# Altium schematic sheet Ethernet.SchDoc: Ethernet
size A3; Author: A.Horvath; Organization: Reichle & De-Massari; Address1: Binzstrasse 32; Address2: 8620 Wetzikon; Address3: Switzerland; DocumentNumber: 8; Revision: V0.1; SheetNumber: 8; SheetTotal: 11
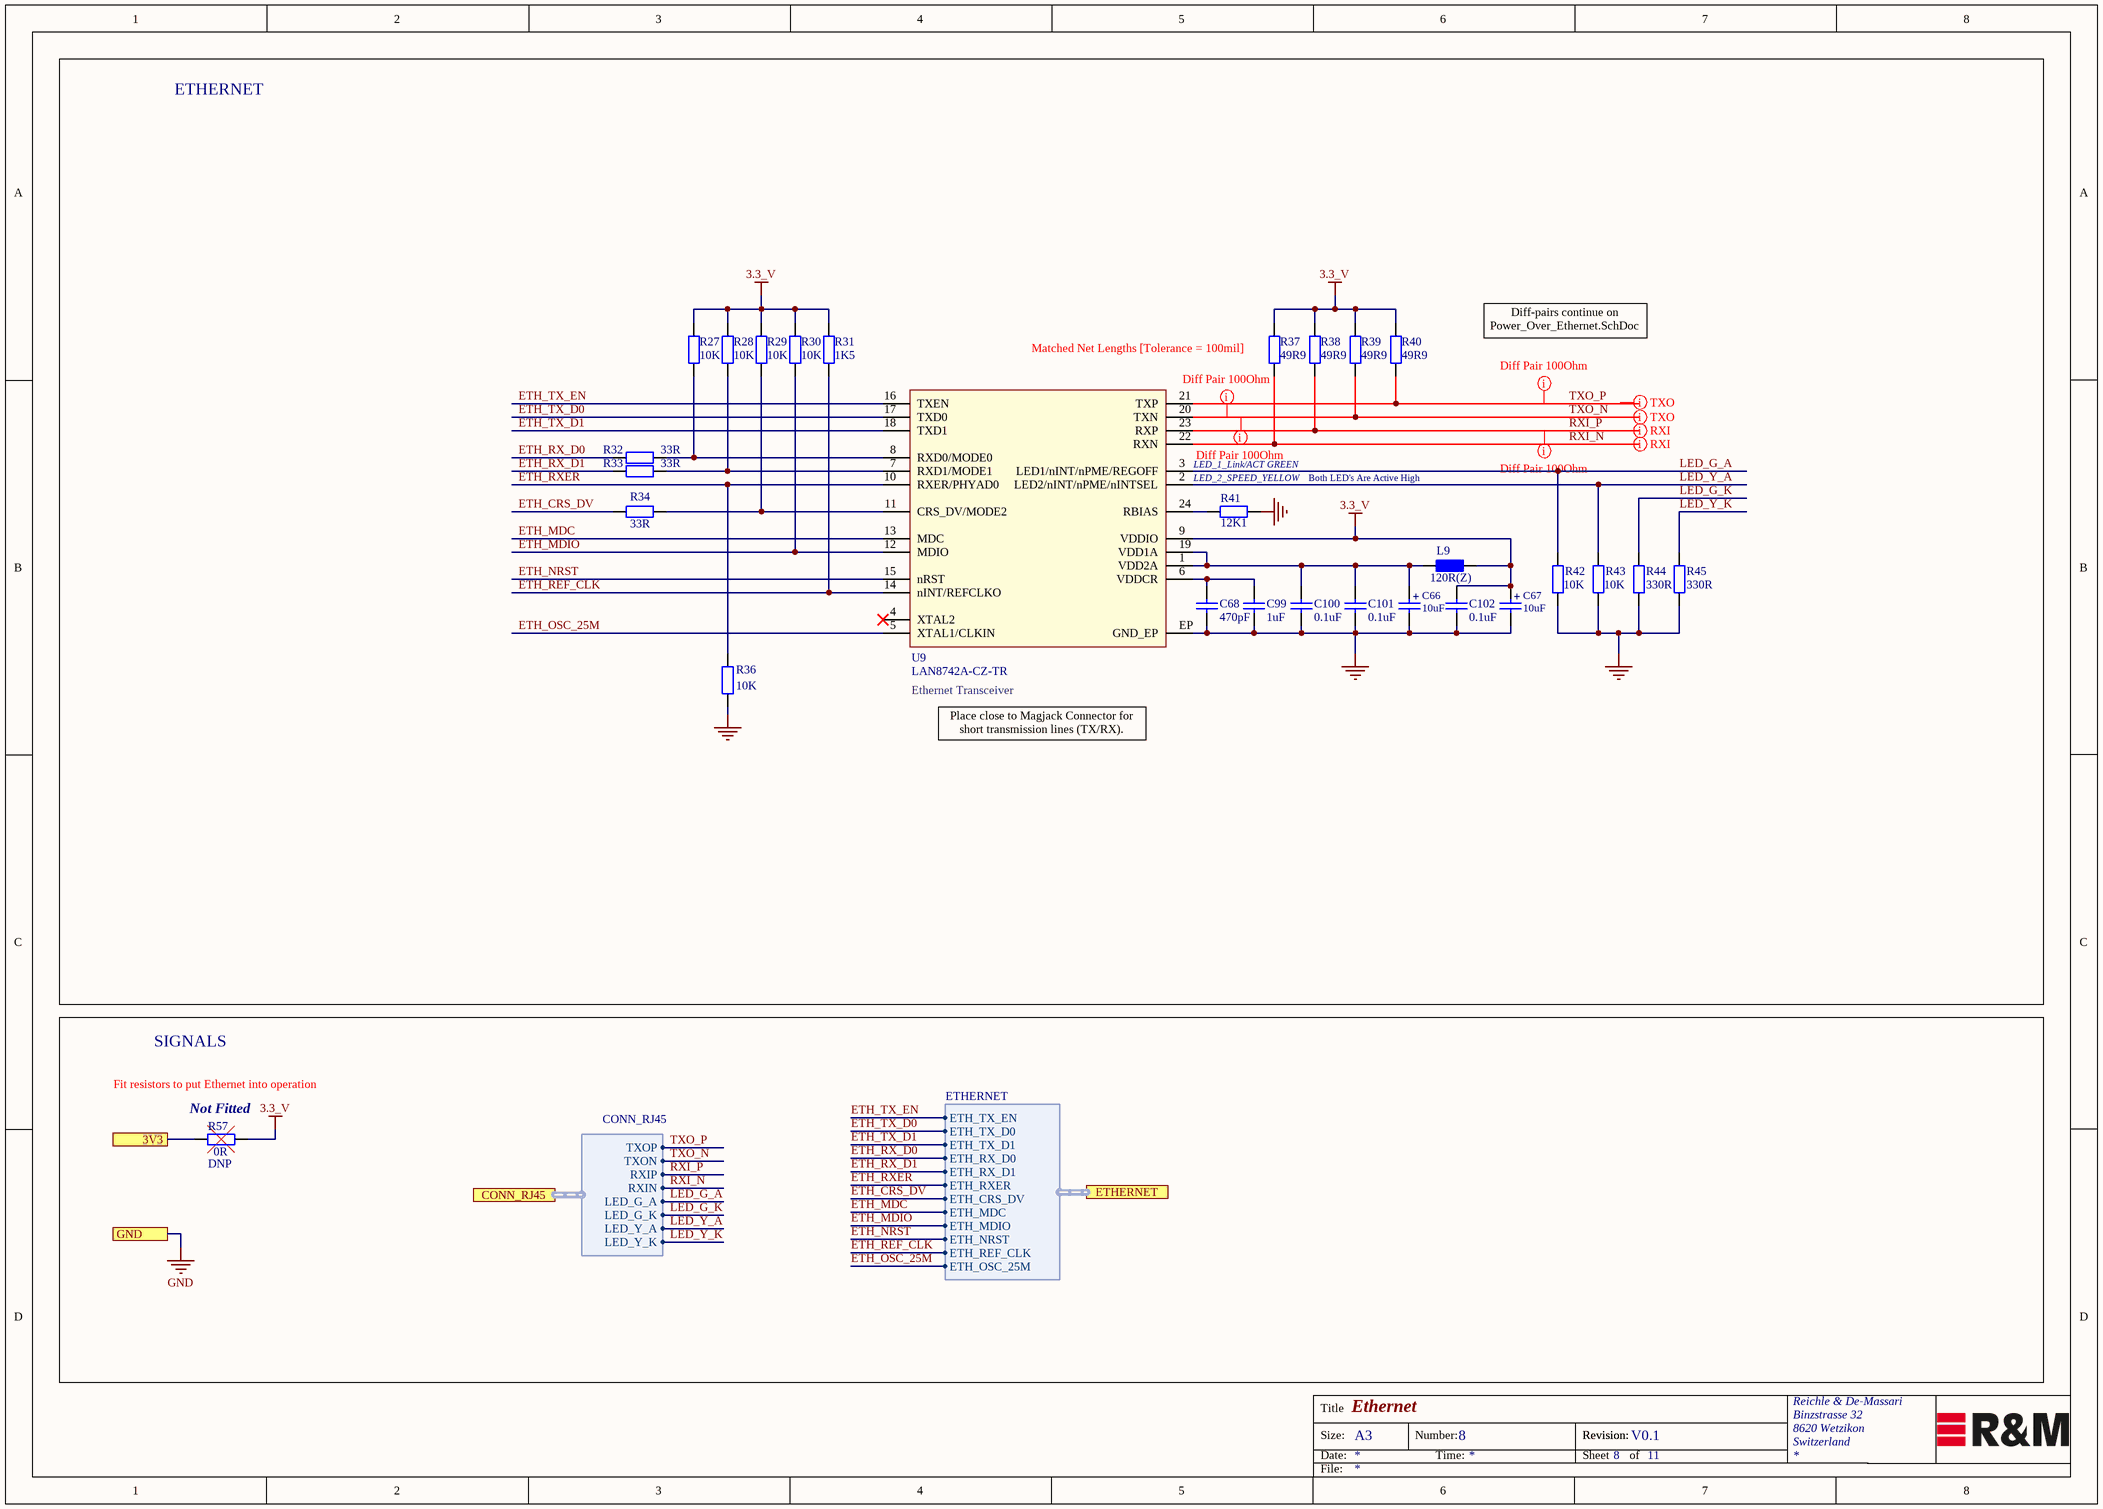
[diagram p0: Ethernet.SchDoc]

## Parts
C66  10uF  [293D106X9010A2TE3]
C67  10uF  [293D106X9010A2TE3]
C68  470pF  [Ceramic Capacitor 0402 EIA]
C99  1uF  [Ceramic Capacitor 0402 EIA]
C100  0.1uF  [Ceramic Capacitor 0402 EIA]
C101  0.1uF  [Ceramic Capacitor 0402 EIA]
C102  0.1uF  [Ceramic Capacitor 0402 EIA]
L9  120R(Z)  [Inductor 0603 EIA]
R27  10K  [Resistor 0402 EIA]
R28  10K  [Resistor 0402 EIA]
R29  10K  [Resistor 0402 EIA]
R30  10K  [Resistor 0402 EIA]
R31  1K5  [Resistor 0402 EIA]
R32  33R  [Resistor 0402 EIA]
R33  33R  [Resistor 0402 EIA]
R34  33R  [Resistor 0402 EIA]
R36  10K  [Resistor 0402 EIA]
R37  49R9  [Resistor 0402 EIA]
R38  49R9  [Resistor 0402 EIA]
R39  49R9  [Resistor 0402 EIA]
R40  49R9  [Resistor 0402 EIA]
R41  12K1  [Resistor 0402 EIA]
R42  10K  [Resistor 0402 EIA]
R43  10K  [Resistor 0402 EIA]
R44  330R  [Resistor 0402 EIA]
R45  330R  [Resistor 0402 EIA]
R57  DNP  [Resistor 0805 EIA]
U9  LAN8742A-CZ-TR  [VQFN24-EPAD_4X4]

## Blocks framed on the sheet
ETHERNET: C66-C68 C99-C102 L9 R27-R34 R36-R45 U9
SIGNALS: R57

## Ports
3V3, CONN_RJ45 (harness CONN_RJ45), ETHERNET (harness ETHERNET), GND

## Harnesses
CONN_RJ45: TXOP, TXON, RXIP, RXIN, LED_G_A, LED_G_K, LED_Y_A, LED_Y_K
ETHERNET: ETH_TX_EN, ETH_TX_D0, ETH_TX_D1, ETH_RX_D0, ETH_RX_D1, ETH_RXER, ETH_CRS_DV, ETH_MDC, ETH_MDIO, ETH_NRST, ETH_REF_CLK, ETH_OSC_25M

## Nets
3.3_V: C67.1(Pos) C102.2 L9.2 R27.1 R28.1 R29.1 R30.1 R31.1 R37.1 R38.1 R39.1 R40.1 R57.2 U9.9(VDDIO)
GND: C66.2(Neg) C67.2(Neg) C68.1 C99.1 C100.1 C101.1 C102.1 R36.2 R41.2 R42.2 R43.2 R44.2 R45.2 U9.EP(GND_EP) ; port GND
3V3: R57.1 ; port 3V3
ETH_CRS_DV: R34.1 ; port ETHERNET.ETH_CRS_DV
ETH_MDC: U9.13(MDC) ; port ETHERNET.ETH_MDC
ETH_MDIO: R30.2 U9.12(MDIO) ; port ETHERNET.ETH_MDIO
ETH_NRST: U9.15(nRST) ; port ETHERNET.ETH_NRST
ETH_OSC_25M: U9.5(XTAL1/CLKIN) ; port ETHERNET.ETH_OSC_25M
ETH_REF_CLK: R31.2 U9.14(nINT/REFCLKO) ; port ETHERNET.ETH_REF_CLK
ETH_RX_D0: R32.1 ; port ETHERNET.ETH_RX_D0
ETH_RX_D1: R33.1 ; port ETHERNET.ETH_RX_D1
ETH_RXER: R36.1 U9.10(RXER/PHYAD0) ; port ETHERNET.ETH_RXER
ETH_TX_D0: U9.17(TXD0) ; port ETHERNET.ETH_TX_D0
ETH_TX_D1: U9.18(TXD1) ; port ETHERNET.ETH_TX_D1
ETH_TX_EN: U9.16(TXEN) ; port ETHERNET.ETH_TX_EN
LED_G_A: R42.1 U9.3(LED1/nINT/nPME/REGOFF) ; port CONN_RJ45.LED_G_A
LED_G_K: R44.1 ; port CONN_RJ45.LED_G_K
LED_Y_A: R43.1 U9.2(LED2/nINT/nPME/nINTSEL) ; port CONN_RJ45.LED_Y_A
LED_Y_K: R45.1 ; port CONN_RJ45.LED_Y_K
RXI_N: R37.2 U9.22(RXN) ; port CONN_RJ45.RXIN
RXI_P: R38.2 U9.23(RXP) ; port CONN_RJ45.RXIP
TXO_N: R39.2 U9.20(TXN) ; port CONN_RJ45.TXON
TXO_P: R40.2 U9.21(TXP) ; port CONN_RJ45.TXOP
NetC66_1: C66.1(Pos) C100.2 C101.2 L9.1 U9.1(VDD2A) U9.19(VDD1A)
NetC68_2: C68.2 C99.2 U9.6(VDDCR)
NetR27_2: R27.2 R32.2 U9.8(RXD0/MODE0)
NetR28_2: R28.2 R33.2 U9.7(RXD1/MODE1)
NetR29_2: R29.2 R34.2 U9.11(CRS_DV/MODE2)
NetR41_1: R41.1 U9.24(RBIAS)

Not connected (* = marked no-connect by the designer): U9 4(XTAL2)*

## Layout directives
mark named Diff Pair 100Ohm: RXI_P, TXO_N, TXO_P
differential pair: (no net found under the mark), RXI_N, RXI_P, TXO_N

## Notes on the sheet
- (near R37) Matched Net Lengths [Tolerance = 100mil]
- Diff-pairs continue on Power_Over_Ethernet.SchDoc
- LED_1_Link/ACT GREEN
- LED_2_SPEED_YELLOW
- Both LED's Are Active High
- (near U9) Ethernet Transceiver
- Place close to Magjack Connector for short transmission lines (TX/RX).
- (near R57) Fit resistors to put Ethernet into operation
- (near R57) Not Fitted
- (near R57) 0R
- Title
- Size:
- Date:
- A3
- Number:
- Time:
- Revision:
- Sheet
- of
- File:
- (in symbol Cap_10uF_1206 _10V_Tantal) +

## Library data of the parts
C66 C67 = Cap_10uF_1206 _10V_Tantal: 10µF Molded Tantalum Capacitors 10V 1206 (3216 Metric) 3.4Ohm; Manufacturer: Vishay Sprague; Replaceable: yes; tolerance: ±10%; Dielectric Grade: TANTAL; Manufacturer PartNr: 293D106X9010A2TE3; voltage: 10V; Footprint/Package: 1206 (3216 metric); value: 10uF; Supplier 1: Digi-Key; Supplier Part Number 1: 718-1121-1-ND
C68 = Cap_470pF_0402_16V: 470pF ±10% 16V Ceramic Capacitor X7R 0402 (1005 Metric); Manufacturer: AVX Corporation; Manufacturer PartNr: 0402YC471KAT2A; voltage: 16VDC; Replaceable: yes; value: 470pF; tolerance: 10%; ComponentLink1Description: mouser; ComponentLink1URL: https://www.mouser.ch/ProductDetail/Murata-Electronics/GRM155R61A472KA01D?qs=sGAEpiMZZMs0AnBnWHyRQJuLogdu9bcTuSYPL0o17LI%3d; Footprint/Package: 0402 (1005 metric); Dielectric Grade: X7R; Supplier 1: Digi-Key; Supplier Part Number 1: 478-12657-1-ND
C99 = Cap_1uF_0603_16V: 1µF ±10% 16V Ceramic Capacitor X5R 0603 (1608 Metric); Manufacturer: Yageo; Manufacturer PartNr: CC0603KRX5R7BB105; voltage: 16VDC; Replaceable: yes; value: 1uF; tolerance: 10%; Footprint/Package: 0603 (1608 Metric); Dielectric Grade: X5R; ComponentLink1Description: mouser; ComponentLink1URL: https://www.mouser.ch/ProductDetail/Murata-Electronics/GCM155C71A105KE38D?qs=sGAEpiMZZMsh%252b1woXyUXj0FEAttKcN54ouz5zO04smg%3d; Supplier Part Number 1: 311-1444-1-ND; Supplier 1: Digi-Key
C100-C102 = Cap_0.1uF_0402_16V_10%: 0.1µF ±10% 16V Ceramic Capacitor X7R 0402 (1005 Metric); Manufacturer: Yageo; Manufacturer PartNr: CC0402KRX7R7BB104; voltage: 16VDC; Replaceable: yes; value: 0.1uF; tolerance: 10%; Footprint/Package: 0402 (1005 Metric); Dielectric Grade: X7R; ComponentLink1Description: mouser; ComponentLink1URL: https://www.mouser.ch/ProductDetail/KEMET/C0402C104M4RACAUTO?qs=sGAEpiMZZMs0AnBnWHyRQB295tntAovf0Dzw3tVX6zRfKTwHFThmZw%3d%3d; Supplier 1: Digi-Key; Supplier Part Number 1: 311-1338-1-ND
L9 = Ferrit_Bead_0603_BLM18PG121SN1D: 120 Ohms @ 100MHz 1 Power Line Ferrite Bead 0603 (1608 Metric) 2A 50mOhm; Manufacturer: Murata Electronics; Replaceable: yes; value: 120R(Z); tolerance: -; power: -; Manufacturer PartNr: BLM18PG121SN1D; Footprint/Package: 0603 (1608 metric); Supplier 1: Digi-Key; Supplier Part Number 1: 490-1037-1-ND; Dielectric Grade: -
R27-R30 R36 R42 R43 = Res_10K_0402: SMD 10K ohm 1% 50V General Purpose; Manufacturer: Yageo; Manufacturer PartNr: RC0402FR-1010KL; power: 63mW; Replaceable: yes; value: 10K; tolerance: 1%; ComponentLink1Description: mouser; ComponentLink1URL: https://www.mouser.ch/ProductDetail/Yageo/RC0402FR-1010KL?qs=sGAEpiMZZMtlubZbdhIBIEgN9MQql2m6Sb2LnYlCICU%3d; Footprint/Package: 0402; Supplier 1: Mouser; Supplier Part Number 1: 603-RC0402FR-1010KL; Supplier 2: Digi-Key; Supplier Part Number 2: *
R31 = Res_1K5_0402: 1 kOhms ±0.5% 0.063W, 1/16W Chip Resistor 0402 (1005 Metric) Thin Film; Manufacturer: TE Connectivity; Manufacturer PartNr: CRGCQ0402F1K5; tolerance: ±1%; Replaceable: yes; value: 1K5; power: 1/16W; Footprint/Package: 0402 (1005 metric); Supplier 1: Digi-Key; Supplier Part Number 1: A129629CT-ND
R32-R34 = Res_33R_0402: 33 Ohms ±0.1% 0.063W, 1/16W Chip Resistor 0402 (1005 Metric) Thin Film; Manufacturer: TE Connectivity; Manufacturer PartNr: CPF0402B33RE1; Replaceable: yes; Dielectric Grade: -; Footprint/Package: 0402 (1005metric); power: 0.063W, 1/16W; Supplier 1: Digi-Key; Supplier Part Number 1: A102801CT-ND; tolerance: ±0.1%; value: 33R
R37-R40 = Res_49R9_0402: 49.9 Ohms ±0.1% 0.063W, 1/16W Chip Resistor 0402 (1005 Metric) Automotive AEC-Q200 Thin Film; Manufacturer: Panasonic Electronic Components; Manufacturer PartNr: ERA-2AEB49R9X; Replaceable: yes; voltage: NA; value: 49R9; tolerance: ±0.1%; power: 0.063W, 1/16W; Footprint/Package: 0402 (1005 metric); Supplier 1: Digi-Key; Supplier Part Number 1: P49.9DCCT-ND; DIelectric Grade: NA
R41 = Res_12K1_0402: 12.1 kOhms ±1% 0.063W, 1/16W Chip Resistor 0402 (1005 Metric) Moisture Resistant Thick Film; Manufacturer: Yageo; Manufacturer PartNr: RC0402FR-0712K1L; Replaceable: yes; value: 12K1; tolerance: ±1%; power: 1/16W; Footprint/Package: 0402 (1005 metric); Supplier 1: Digi-Key; Supplier Part Number 1: 311-12.1KLRCT-ND
R44 R45 = Res_330R_0402: 330 Ohms ±0.1% 0.063W, 1/16W Chip Resistor 0402 (1005 Metric) Automotive AEC-Q200 Thin Film; Manufacturer: Panasonic Electronic Components; Manufacturer PartNr: ERA-2AEB331X; Replaceable: yes; Dielectric Grade: -; Footprint/Package: 0402 (1005metric); power: 0.063W, 1/16W; Supplier 1: Digi-Key; Supplier Part Number 1: P330DCCT-ND; tolerance: ±0.1%; value: 330R
R57 = Res_DNP_0805: Resistor: do not populate; Replaceable: no; value: DNP; tolerance: *; power: *; Manufacturer: do not populate; Footprint/Package: 0805; Manufacturer PartNr: do not populate
U9 = LAN8742A-CZ-TR: 10/100M RMII Ethernet transceiver  24-SQFN (4x4); Manufacturer: MICROCHIP; voltage: 1.6V ~ 3.6V; Replaceable: no; Supplier 1: Digi-Key; Supplier Part Number 1: LAN8742A-CZ-CT-ND; tolerance: -; Manufacturer PartNr: LAN8742A-CZ-TR; ComponentLink1Description: Datasheet; ComponentLink1URL: http://tunmcdsvn.tun.st.com/Component_Datasheet_Library/Trunk/IC/MICROCHIP_LAN8742A_RMII_PHY; Footprint/Package: 24-VFQFN Exposed Pad; Dielectric Grade: -; value: LAN8742A-CZ-TR